# EAGLE design ConnectorTest (EAGLE 7.5.0)
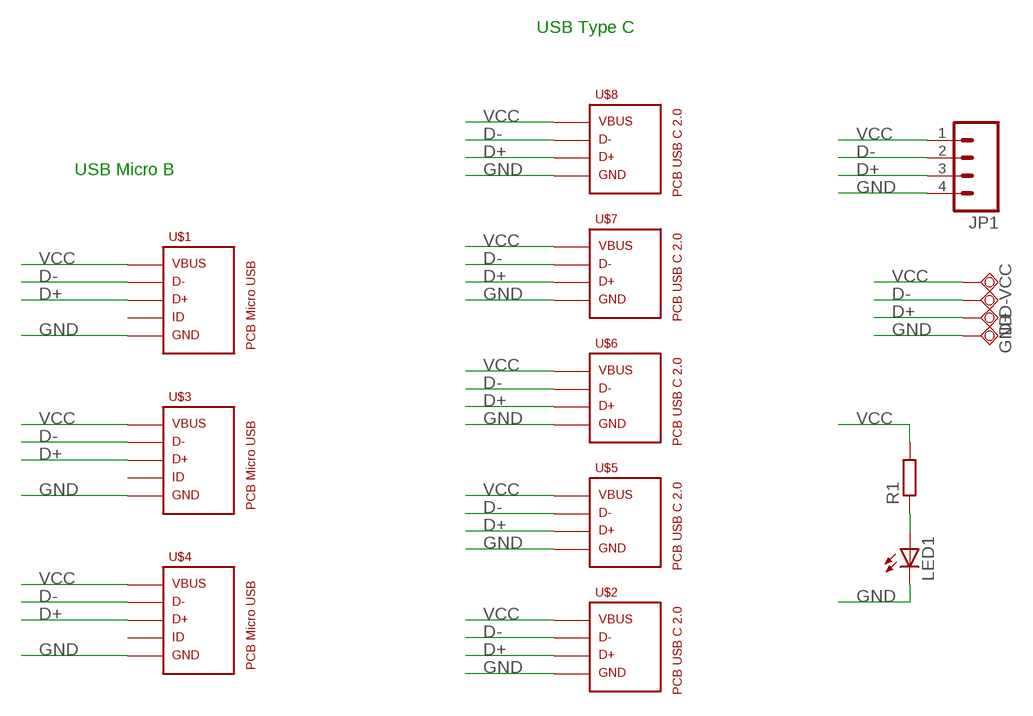
[diagram p0: schematic, sheet 1]

## Parts
D+  TPSQTP20SQ  [TP20SQ]
D-  TPSQTP20SQ  [TP20SQ]
GND  TPSQTP20SQ  [TP20SQ]
JP1  M04LONGPADS  [1X04_LONGPADS]
LED1  LEDSMT1206  [1206]
R1  R-EU_R1206  [R1206]
U$1  PCB_MICRO_USB_BDSW_2  [USB_TYPE_B_DSW_2]
U$2  PCB_USB_C_2.0W_1  [USB_TYPE_C_W_2.0_1]
U$3  PCB_MICRO_USB_BDSW_3  [USB_TYPE_B_DSW_3]
U$4  PCB_MICRO_USB_BDSW_1  [USB_TYPE_B_DSW_1]
U$5  PCB_USB_C_2.0W_2  [USB_TYPE_C_W_2.0_2]
U$6  PCB_USB_C_2.0W_3  [USB_TYPE_C_W_2.0_3]
U$7  PCB_USB_C_2.0W_4  [USB_TYPE_C_W_2.0_4]
U$8  PCB_USB_C_2.0W_5  [USB_TYPE_C_W_2.0_5]
VCC  TPSQTP20SQ  [TP20SQ]

## Nets
D+: D+.TP JP1.3 U$1.3D U$2.D+ U$3.3D U$4.3D U$5.D+ U$6.D+ U$7.D+ U$8.D+
D-: D-.TP JP1.2 U$1.2D U$2.D- U$3.2D U$4.2D U$5.D- U$6.D- U$7.D- U$8.D-
GND: GND.TP JP1.4 LED1.C U$1.5D U$2.GND U$3.5D U$4.5D U$5.GND U$6.GND U$7.GND U$8.GND
N$1: LED1.A R1.1
VCC: JP1.1 R1.2 U$1.1D U$2.VBUS U$3.1D U$4.1D U$5.VBUS U$6.VBUS U$7.VBUS U$8.VBUS VCC.TP
Unconnected: U$1.4 U$1.4B U$3.4 U$3.4B U$4.4 U$4.4B

## Notes on the sheet
- USB Type C
- USB Micro B

## Library data of the parts
D+ D- GND VCC = testpad:TPSQ: Test pad
JP1 = 01_SparkFun:M04: Header 4 Standard 4-pin 0.1" header. Use with straight break away headers (SKU : PRT-00116), right angle break away headers (PRT-00553), swiss pins (PRT-00743), machine pins (PRT-00117), and female headers (PRT-00115). Molex polarized connector foot print use with SKU : PRT-08231 with associated crimp pins and housings.
LED1 = 01_adafruit:LED: LED OSRAM: - CHIPLED LG R971, LG N971, LY N971, LG Q971, LY Q971, LO R971, LY R971 LH N974, LH R974 LS Q976, LO Q976, LY Q976 LO Q996 - Hyper CHIPLED LW Q18S LB Q993, LB Q99A, LB R99A - SideLED LS A670, LO A670, LY A670, LG A670, LP A670 LB A673, LV A673, LT A673, LW A673 LH A674 LY A675 LS A676, LA A676, LO A676, LY A676, LW A676 LS A679, LY A679, LG A679 - Hyper Micro SIDELED® LS Y876, LA Y876, LO Y876, LY Y876 LT Y87S - SmartLED LW L88C, LW L88S LB L89C, LB L89S, LG L890 LS L89K, LO L89K, LY L89K LS L896, LA L896, LO L896, LY L896 - TOPLED LS T670, LO T670, LY T670, LG T670, LP T670 LSG T670, LSP T670, LSY T670, LOP T670, LYG T670 LG T671, LOG T671, LSG T671 LB T673, LV T673, LT T673, LW T673 LH T674 LS T676, LA T676, LO T676, LY T676, LB T676, LH T676, LSB T676, LW T676 LB T67C, LV T67C, LT T67C, LS T67K, LO T67K, LY T67K, LW E67C LS E67B, LA E67B, LO E67B, LY E67B, LB E67C, LV E67C, LT E67C LW T67C LS T679, LY T679, LG T679 LS T770, LO T770, LY T770, LG T770, LP T770 LB T773, LV T773, LT T773, LW T773 LH T774 LS E675, LA E675, LY E675, LS T675 LS T776, LA T776, LO T776, LY T776, LB T776 LHGB T686 LT T68C, LB T68C - Hyper Mini TOPLED® LB M676 - Mini TOPLED Santana® LG M470 LS M47K, LO M47K, LY M47K Source: http://www.osram.convergy.de/
R1 = rcl:R-EU_: RESISTOR, European symbol
U$1 U$3 U$4 = USB_pcb_connectors:PCB_MICRO_USB_B
U$2 U$5-U$8 = USB_pcb_connectors:PCB_USB_C_2.0

## Board
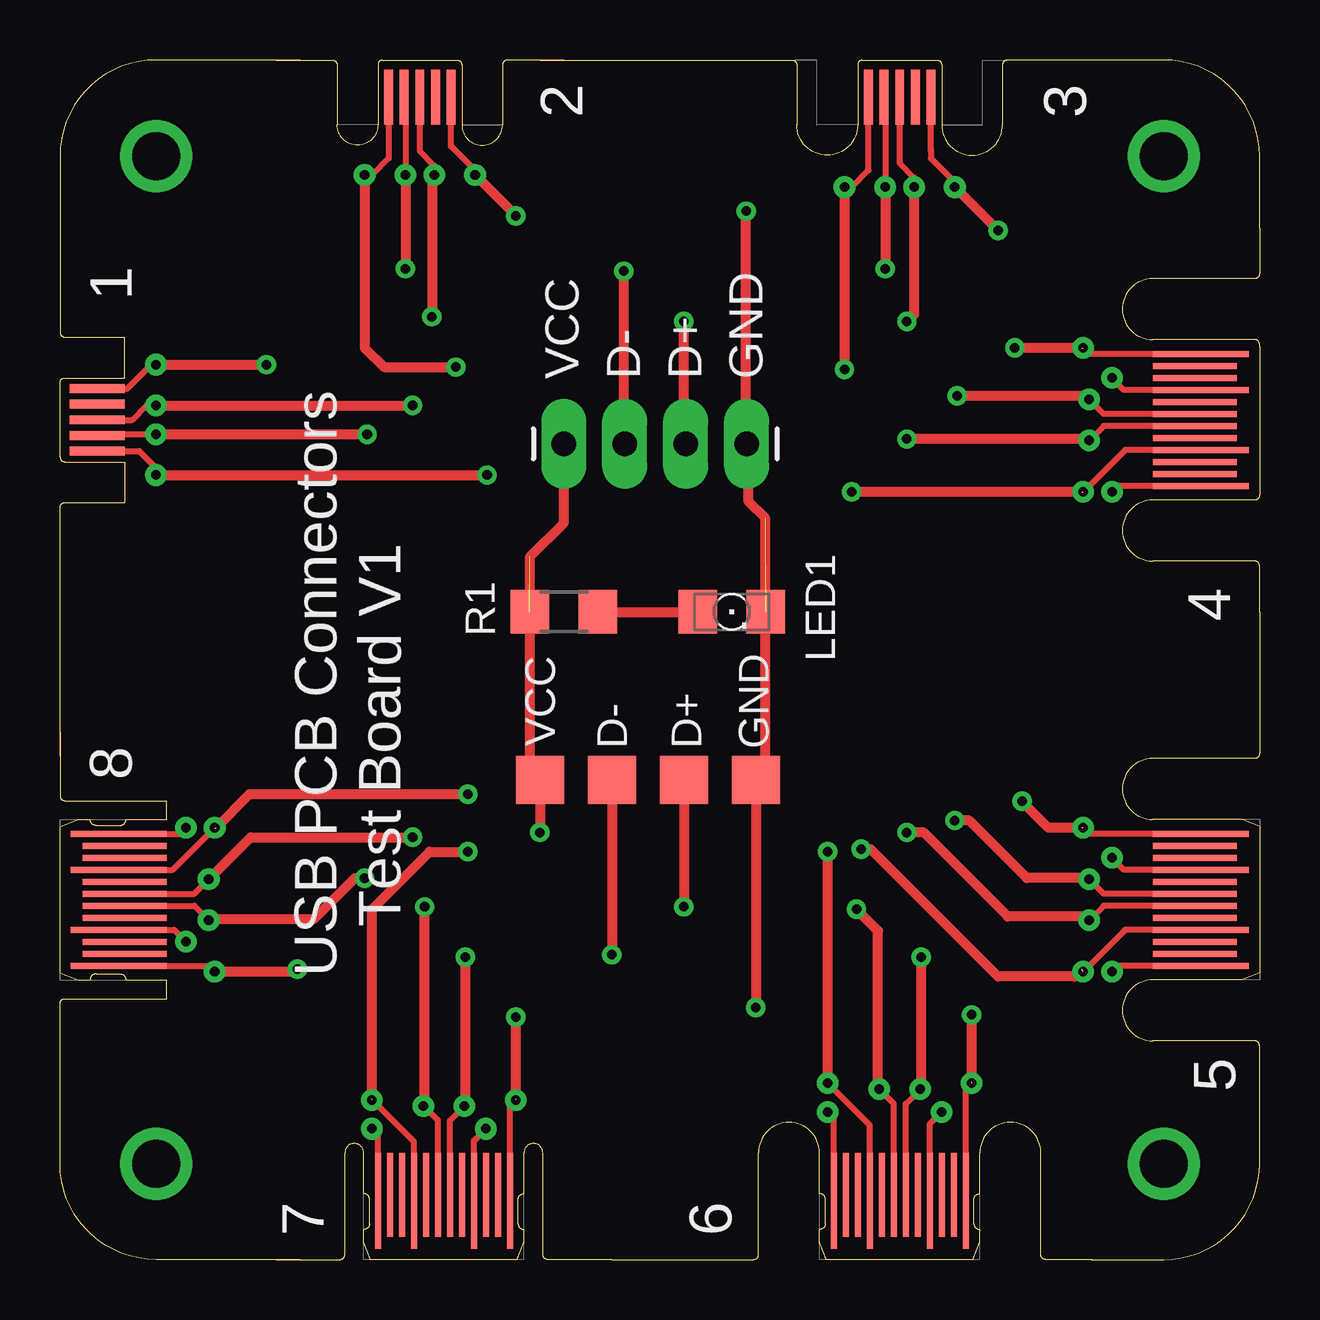
[diagram p1: board, top side]
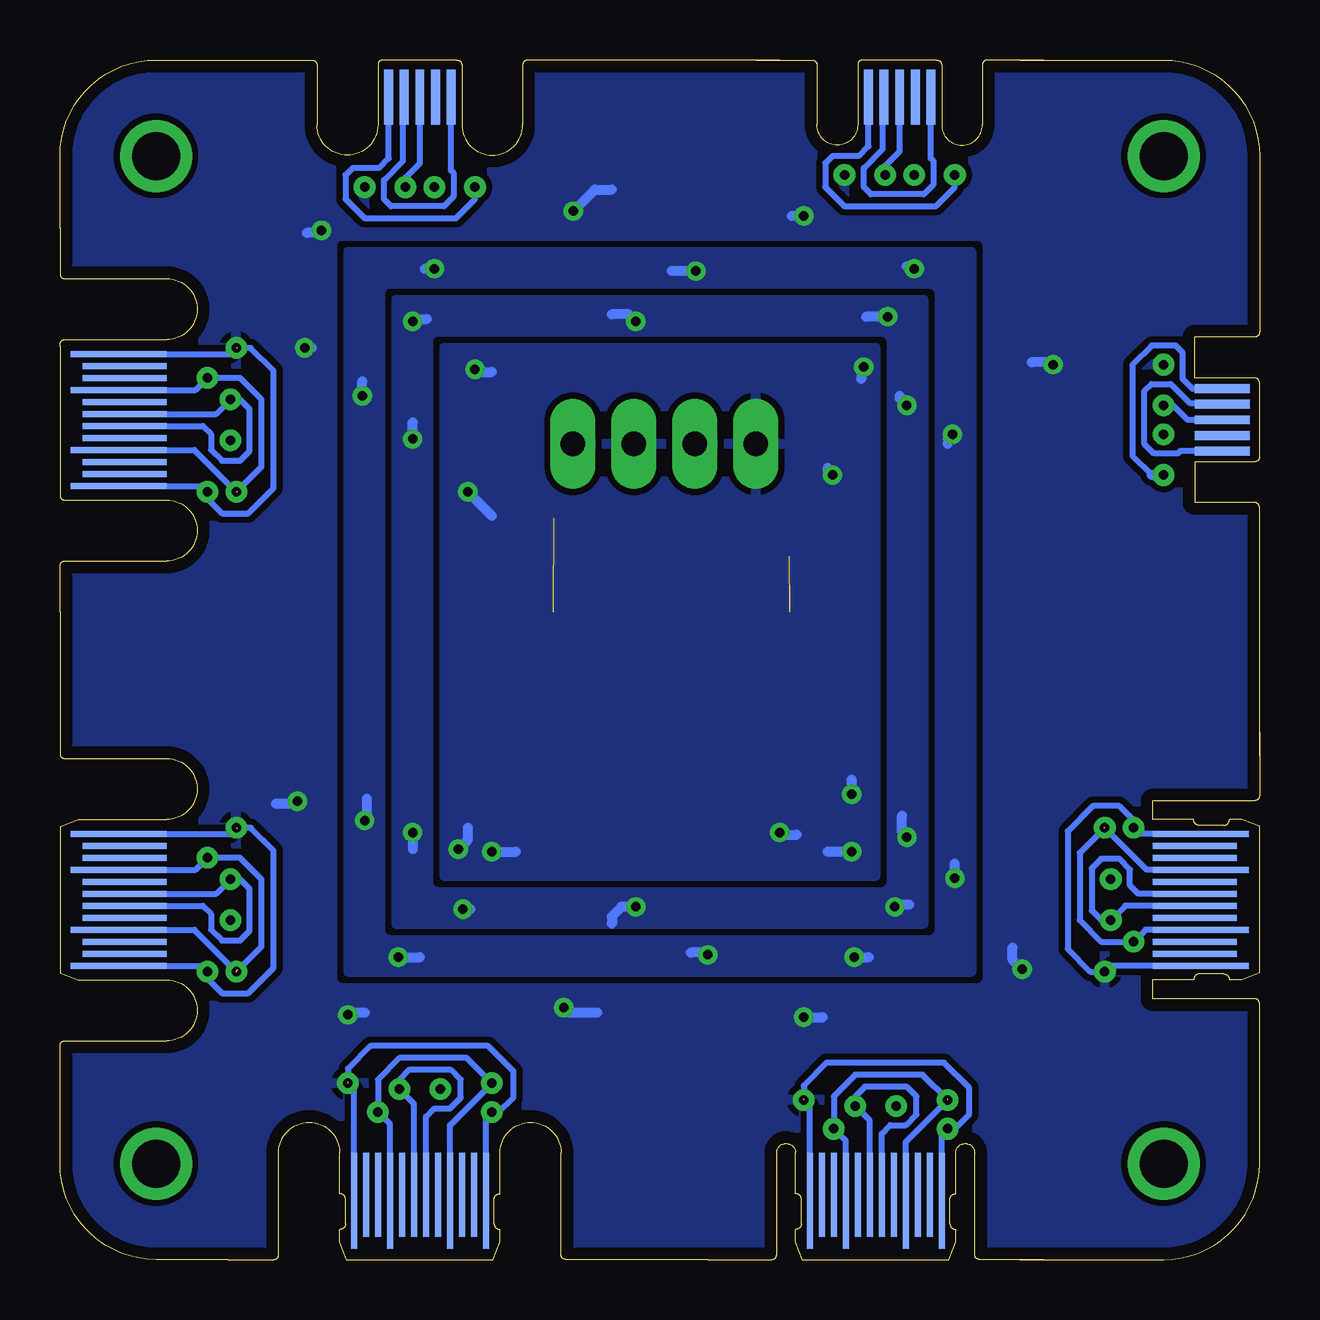
[diagram p2: board, bottom side, seen from below]

Size 50 x 50 mm. Coordinates in mm from the lower left corner, seen from the top.
Outline: 10,50 4,50 arc90 0,46 0,40
Outline: 20,50 30,50
Outline: 50,43 50,46 arc90 46,50 40,50
Outline: 0,21 0,29
Outline: 10,0 4,0 arc-90 0,4 0,9
Outline: 50,27 50,22
Outline: 43,0 46,0 arc90 50,4 50,7
Outline: 23,0 28,0
Copper layers (1*16): Top 0.035mm / dielectric 1.5mm / Bottom 0.035mm
Design rules "default *": minimum track width 10mil, minimum drill 24mil, track to track 8mil, track to pad 8mil, pad to pad 8mil, via to via 8mil, smd to smd 8mil, copper to edge 20mil, drill to drill 8mil, minimum pad ring 10mil, minimum via ring 8mil, stop-mask expansion 4mil, vias tented up to drill 20mil, thermal gap 10mil

### Footprints (pad centres in the part's own frame; a part is rotated, then mirrored left to right if it is on the bottom)
TP20SQ = smd 2 x 2: TP 0,0
1X04_LONGPADS = drill 1.016 pad 1.88 long: 1 0,0; 2 2.54,0; 3 5.08,0; 4 7.62,0
1206 = smd 1.6 x 1.803: A -1.422,0; C 1.422,0
R1206 = smd 1.6 x 1.803: 1 -1.422,0; 2 1.422,0
USB_TYPE_B_DSW_2 = smd 0.37 x 2.3: 1 -1.3,-1.55; 2 -0.65,-1.55; 3 0,-1.55; 4 0.65,-1.55; 5 1.3,-1.55 | smd 0.37 x 2.3 bottom: 1B 1.3,-1.55; 2B 0.65,-1.55; 3B 0,-1.55; 4B -0.65,-1.55; 5B -1.3,-1.55 | drill 0.4: 1D -2.3,-4.79; 2D -0.6,-4.79; 3D 0.6,-4.79; 5D 2.3,-4.79
USB_TYPE_C_W_2.0_1 = smd 0.25 x 4: A1 2.75,-2.45; A4 1.25,-2.45; A9 -1.25,-2.45; A12 -2.75,-2.45 | smd 0.25 x 3.5: A2 2.25,-2.7; A3 1.75,-2.7; A5 0.75,-2.7; A6 0.25,-2.7; A7 -0.25,-2.7; A8 -0.75,-2.7; A10 -1.75,-2.7; A11 -2.25,-2.7 | smd 0.25 x 4 bottom: B1 -2.75,-2.45; B4 -1.25,-2.45; B9 1.25,-2.45; B12 2.75,-2.45 | smd 0.25 x 3.5 bottom: B2 -2.25,-2.7; B3 -1.75,-2.7; B5 -0.75,-2.7; B6 -0.25,-2.7; B7 0.25,-2.7; B8 0.75,-2.7; B10 1.75,-2.7; B11 2.25,-2.7 | drill 0.4: D+ 0.85,-6.2; D- -0.85,-6.2; GND -3,-6.45; P$5 -1.75,-5.25; P$6 3,-5.25; VBUS 3,-6.45
USB_TYPE_B_DSW_3 = smd 0.37 x 2.3: 1 -1.3,-1.55; 2 -0.65,-1.55; 3 0,-1.55; 4 0.65,-1.55; 5 1.3,-1.55 | smd 0.37 x 2.3 bottom: 1B 1.3,-1.55; 2B 0.65,-1.55; 3B 0,-1.55; 4B -0.65,-1.55; 5B -1.3,-1.55 | drill 0.4: 1D -2.3,-5.296; 2D -0.6,-5.296; 3D 0.6,-5.296; 5D 2.3,-5.296
USB_TYPE_B_DSW_1 = smd 0.37 x 2.3: 1 -1.3,-1.55; 2 -0.65,-1.55; 3 0,-1.55; 4 0.65,-1.55; 5 1.3,-1.55 | smd 0.37 x 2.3 bottom: 1B 1.3,-1.55; 2B 0.65,-1.55; 3B 0,-1.55; 4B -0.65,-1.55; 5B -1.3,-1.55 | drill 0.4: 1D -2.3,-4; 2D -0.6,-4; 3D 0.6,-4; 5D 2.3,-4
USB_TYPE_C_W_2.0_2 = smd 0.25 x 4: A1 2.75,-2.45; A4 1.25,-2.45; A9 -1.25,-2.45; A12 -2.75,-2.45 | smd 0.25 x 3.5: A2 2.25,-2.7; A3 1.75,-2.7; A5 0.75,-2.7; A6 0.25,-2.7; A7 -0.25,-2.7; A8 -0.75,-2.7; A10 -1.75,-2.7; A11 -2.25,-2.7 | smd 0.25 x 4 bottom: B1 -2.75,-2.45; B4 -1.25,-2.45; B9 1.25,-2.45; B12 2.75,-2.45 | smd 0.25 x 3.5 bottom: B2 -2.25,-2.7; B3 -1.75,-2.7; B5 -0.75,-2.7; B6 -0.25,-2.7; B7 0.25,-2.7; B8 0.75,-2.7; B10 1.75,-2.7; B11 2.25,-2.7 | drill 0.4: D+ 0.85,-6.4; D- -0.85,-6.4; GND -3,-6.65; P$5 -1.75,-5.45; P$6 3,-5.45; VBUS 3,-6.65
USB_TYPE_C_W_2.0_3 = smd 0.25 x 4: A1 2.75,-2.45; A4 1.25,-2.45; A9 -1.25,-2.45; A12 -2.75,-2.45 | smd 0.25 x 3.5: A2 2.25,-2.7; A3 1.75,-2.7; A5 0.75,-2.7; A6 0.25,-2.7; A7 -0.25,-2.7; A8 -0.75,-2.7; A10 -1.75,-2.7; A11 -2.25,-2.7 | smd 0.25 x 4 bottom: B1 -2.75,-2.45; B4 -1.25,-2.45; B9 1.25,-2.45; B12 2.75,-2.45 | smd 0.25 x 3.5 bottom: B2 -2.25,-2.7; B3 -1.75,-2.7; B5 -0.75,-2.7; B6 -0.25,-2.7; B7 0.25,-2.7; B8 0.75,-2.7; B10 1.75,-2.7; B11 2.25,-2.7 | drill 0.4: D+ 0.85,-7.1; D- -0.85,-7.1; GND -3,-7.35; P$5 -1.75,-6.15; P$6 3,-6.15; VBUS 3,-7.35
USB_TYPE_C_W_2.0_4 = smd 0.25 x 4: A1 2.75,-2.45; A4 1.25,-2.45; A9 -1.25,-2.45; A12 -2.75,-2.45 | smd 0.25 x 3.5: A2 2.25,-2.7; A3 1.75,-2.7; A5 0.75,-2.7; A6 0.25,-2.7; A7 -0.25,-2.7; A8 -0.75,-2.7; A10 -1.75,-2.7; A11 -2.25,-2.7 | smd 0.25 x 4 bottom: B1 -2.75,-2.45; B4 -1.25,-2.45; B9 1.25,-2.45; B12 2.75,-2.45 | smd 0.25 x 3.5 bottom: B2 -2.25,-2.7; B3 -1.75,-2.7; B5 -0.75,-2.7; B6 -0.25,-2.7; B7 0.25,-2.7; B8 0.75,-2.7; B10 1.75,-2.7; B11 2.25,-2.7 | drill 0.4: D+ 0.85,-7.1; D- -0.85,-7.1; GND -3,-7.35; P$5 -1.75,-6.15; P$6 3,-6.15; VBUS 3,-7.35
USB_TYPE_C_W_2.0_5 = smd 0.25 x 4: A1 2.75,-2.45; A4 1.25,-2.45; A9 -1.25,-2.45; A12 -2.75,-2.45 | smd 0.25 x 3.5: A2 2.25,-2.7; A3 1.75,-2.7; A5 0.75,-2.7; A6 0.25,-2.7; A7 -0.25,-2.7; A8 -0.75,-2.7; A10 -1.75,-2.7; A11 -2.25,-2.7 | smd 0.25 x 4 bottom: B1 -2.75,-2.45; B4 -1.25,-2.45; B9 1.25,-2.45; B12 2.75,-2.45 | smd 0.25 x 3.5 bottom: B2 -2.25,-2.7; B3 -1.75,-2.7; B5 -0.75,-2.7; B6 -0.25,-2.7; B7 0.25,-2.7; B8 0.75,-2.7; B10 1.75,-2.7; B11 2.25,-2.7 | drill 0.4: D+ 0.85,-7.1; D- -0.85,-7.1; GND -3,-7.35; P$5 -1.75,-6.15; P$6 3,-6.15; VBUS 3,-7.35

### Placement (x,y rotation side)
D+  26,20 0 top
D-  23,20 0 top
GND  29,20 0 top
JP1  21,34 0 top
LED1  28,27 0 top
R1  21,27 180 top
U$1  15,50 0 top
U$2  0,15 90 top
U$3  35,50 0 top
U$4  0,35 90 top
U$5  16,0 180 top
U$6  35,0 180 top
U$7  50,15 270 top
U$8  50,35 270 top
VCC  20,20 0 top

### Tracks (layer width: path | path; a pad name or v marks a point on that pad's centre or on a via)
D+  (via drill 0.4)
  Top 0.406: U$4.3D v14.7,35.6 | U$1.3D 15.5,45.11 v15.5,39.3 | U$3.3D 35.6,39.4 v35.3,39.1 | U$8.D+ 42.85,34.2 v35.3,34.2 | U$6.D+ 34.1,7.15 34.1,13.7 v33.2,14.6 | U$5.D+ 15.2,6.45 v15.2,14.7 | U$2.D+ 7.95,17.6 v14.7,17.6 | D+.TP v26,14.7 | JP1.3 26,34.08 v26,39.1 | U$7.D+ 42.75,14.3 39.5,14.3 36,17.8 v35.3,17.8
  Bottom 0.406: v14.7,35.6 15,35.9 15,36 | v15.5,39.3 16.4,39.3 | v35.3,39.1 35.2,39.2 34.7,39.2 | v35.3,34.2 35.3,34.9 | v33.2,14.6 32.9,14.6 | v15.2,14.7 15.1,14.8 14.6,14.8 | v14.7,17.6 14.9,17.8 14.9,18.5 | v26,14.7 26.6,14.7 27,14.3 27,14 | v26,39.1 26.3,39.4 27,39.4 | v35.3,17.8 35.3,17.1
  pour Bottom (isolate 0.254, rank 2): 14,40 36,40 36,14 14,14
D-  (via drill 0.4)
  Top 0.406: U$4.2D v12.8,34.4 | U$1.2D v14.4,41.3 | U$3.2D v34.4,41.3 | U$8.D- 42.75,36 v37.4,36 | U$6.D- 35.9,7.15 v35.9,12.6 | U$5.D- 16.9,6.45 v16.9,12.6 | U$2.D- 6.25,14.2 10.6,14.2 12.3,15.9 v12.7,15.9 | D-.TP v23,12.7 | JP1.2 23.5,34.04 v23.5,41.2 | U$7.D- 42.85,15.9 40.3,15.9 37.9,18.3 v37.3,18.3
  Bottom 0.406: v12.8,34.4 13,34.2 13,34 | v14.4,41.3 14.5,41.4 14.7,41.4 | v34.4,41.3 34.8,41.3 | v37.4,36 37.4,36.6 | v35.9,12.6 35,12.6 | v16.9,12.6 16.3,12.6 | v12.7,15.9 12.7,16.5 | v23,12.7 23.1,12.8 23.7,12.8 | v23.5,41.2 24.5,41.2 | v37.3,18.3 37.2,18.4 37.2,19.2
  pour Bottom (isolate 0.254, rank 3): 12,42 38,42 38,12 12,12
GND  (via drill 0.4)  (5 unrouted)
  Top 0.406: U$4.5D v8.6,37.3 | U$1.5D v19,43.51 v19,43.5 | U$3.5D v39.1,42.9 | 42.6,38 v39.8,38 | 38,7.4 v38,10.2 | 19,6.7 v19,10.1 | v9.9,12.1 9.8,12 U$2.GND | v29,10.5 GND.TP 29.4,20.4 29.4,30.9 28.7,31.6 28.7,33.9 | JP1.4 28.6,34.02 v28.6,43.7 | 42.6,18 41.2,18 v40.1,19.1
  Bottom 0.406: v8.6,37.3 8.7,37.4 9.5,37.4 | v19,43.5 19.5,43.5 | v39.1,42.9 39.2,42.8 39.7,42.8 | v39.8,38 39.5,38 | v38,10.2 37.9,10.3 37.3,10.3 | v19,10.1 18.2,10.1 | v9.9,12.1 10.3,12.5 10.3,13 | v29,10.5 28.8,10.3 27.6,10.3 | v28.6,43.7 27.7,44.6 27,44.6 | v40.1,19.1 40.2,19 41,19
  pour Bottom (isolate 0.254, rank 4): 0,50 50,50 50,0 0,0
N$1
  Top 0.406: R1.1 LED1.A
N$2  (via drill 2)
  other vias: 4,46
N$3  (via drill 2)
  other vias: 46,46
N$4  (via drill 2)
  other vias: 4,4
N$5  (via drill 2)
  other vias: 46,4
VCC  (via drill 0.4)  (5 unrouted)
  Top 0.406: U$4.1D v17.8,32.7 | U$1.1D 12.7,38 13.5,37.2 v16.5,37.2 | U$3.1D v32.7,37.1 | 42.6,32 v33,32 | U$6.VBUS v32,17 | 13.05,6.7 13,6.7 13,14.6 15.4,17 v17,17 | 6.5,17.95 6.5,18 7.9,19.4 v17,19.4 | v20,17.8 VCC.TP 19.6,20.4 19.6,29.3 21,30.7 21,34.1 | 42.55,12.1 42.6,12.1 42.3,11.8 39.1,11.8 33.8,17.1 v33.4,17.1
  Bottom 0.254: 5.3,37.3 5.3,33.5 4.5,32.7
  Bottom 0.406: 4.5,32.7 U$4.1D | v17.8,32.7 18,32.9 18,33 | v16.5,37.2 16.6,37.1 16.6,36.7 | v32.7,37.1 32.6,37 32,37 | v33,32 32,31 | v32,17 31,17 | v17,17 18,17 | v17,19.4 17,20 | v20,17.8 19.9,17.7 19.3,17.7 | v33.4,17.1 33,17.5 33,18
  pour Bottom (isolate 0.254): 16,38 34,38 34,16 16,16

### Text on the board
tNames: 2 | 3 | 1 | VCC / D- / D+ / GND | 4 | 8 | USB PCB Connectors / Test Board V1 | 5 | 7 | 6